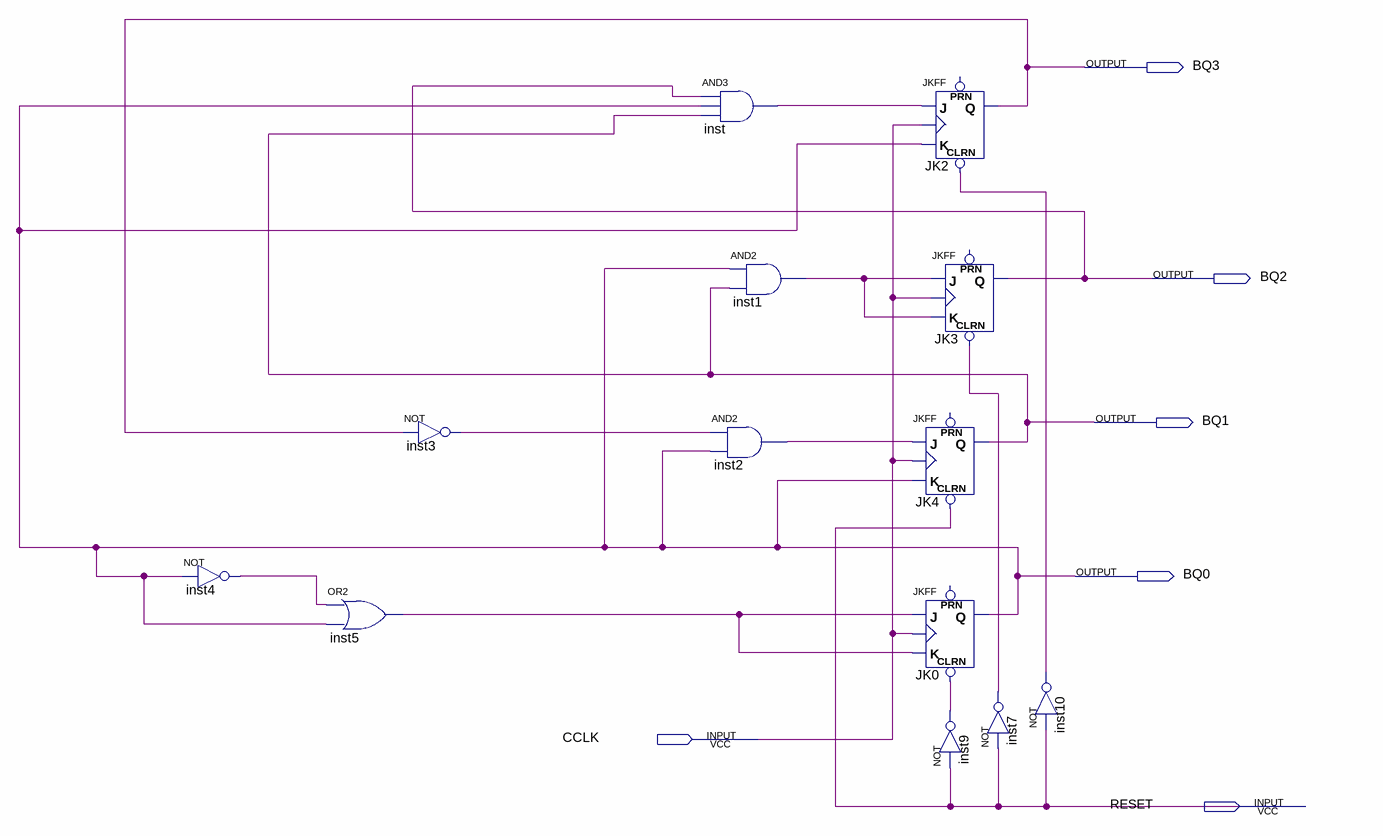
[diagram p0: schematic sheet]
// Quartus schematic lab2PartB.bdf as structural Verilog: 13 symbols, 6 pins
module lab2PartB (
  input  CCLK,
  input  RESET,
  output BQ3,
  output BQ2,
  output BQ1,
  output BQ0
);

  wire inst1_out, inst2_out, inst3_out, inst4_out, inst5_out, inst7_out, inst9_out, inst10_out, inst_out;

  not inst4 (inst4_out, BQ0);
  or inst5 (inst5_out, inst4_out, BQ0);
  not inst3 (inst3_out, BQ3);
  and inst (inst_out, BQ2, BQ0, BQ1);
  and inst1 (inst1_out, BQ0, BQ1);
  and inst2 (inst2_out, inst3_out, BQ0);
  JKFF JK2 (.CLRN(inst10_out), .K(BQ0), .J(inst_out), .CLK(CCLK), .Q(BQ3));  // open: PRN
  JKFF JK4 (.CLRN(RESET), .K(BQ0), .J(inst2_out), .CLK(CCLK), .Q(BQ1));  // open: PRN
  JKFF JK0 (.CLRN(inst9_out), .K(inst5_out), .J(inst5_out), .CLK(CCLK), .Q(BQ0));  // open: PRN
  JKFF JK3 (.CLRN(inst7_out), .K(inst1_out), .J(inst1_out), .CLK(CCLK), .Q(BQ2));  // open: PRN
  not inst7 (inst7_out, RESET);
  not inst9 (inst9_out, RESET);
  not inst10 (inst10_out, RESET);
endmodule
